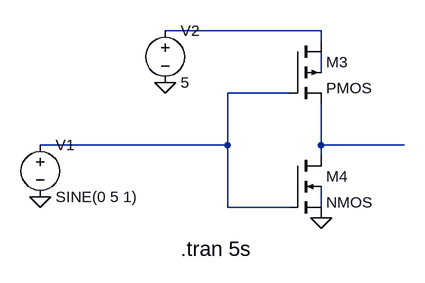
[diagram p0: schematic Draft1.asc]
Draft1.asc, the LTspice schematic file:
Version 4
SHEET 1 1068 680
WIRE 864 128 624 128
WIRE 864 144 864 128
WIRE 864 192 864 160
WIRE 816 224 720 224
WIRE 720 304 720 224
WIRE 720 304 432 304
WIRE 864 304 864 240
WIRE 992 304 864 304
WIRE 864 320 864 304
WIRE 720 400 720 304
WIRE 816 400 720 400
WIRE 864 400 864 368
FLAG 624 208 0
FLAG 864 416 0
FLAG 432 384 0
DATAFLAG 992 304 "$"
SYMBOL pmos4 816 144 R0
SYMATTR InstName M3
SYMBOL nmos4 816 320 R0
SYMATTR InstName M4
SYMBOL Voltage 624 112 R0
SYMATTR InstName V2
SYMATTR Value 5
SYMBOL voltage 432 288 R0
SYMATTR InstName V1
SYMATTR Value SINE(0 5 1)
TEXT 648 464 Left 3 !.tran 5s

The netlist it stands for:
* Draft1.asc
M3 N001 N003 N004 N002 PMOS
M4 N004 N003 0 N005 NMOS
V2 N001 0 5
V1 N003 0 SINE(0 5 1)
.model NMOS NMOS
.model PMOS PMOS
.lib standard.mos
.tran 5s
.backanno
.end